# EAGLE design bvm (EAGLE 8.3.2)
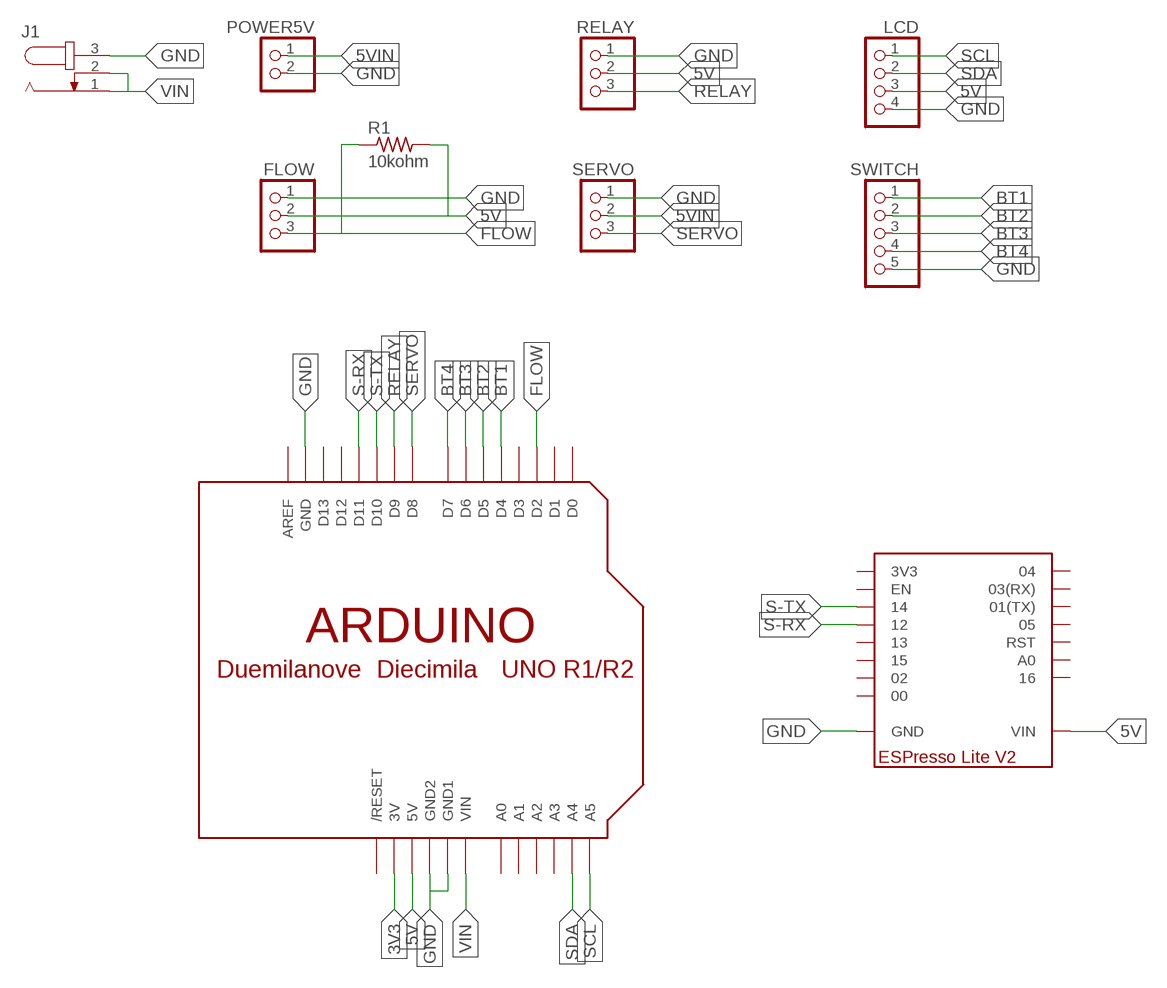
[diagram p0: schematic, sheet 1]

## Parts
FLOW  PINHD-1X3  [1X03]
J1  JACK-PLUG0  [SPC4077]
LCD  PINHD-1X4  [1X04]
POWER5V  PINHD-1X2  [1X02]
R1  10kohm  R-US_0207/10  [0207/10]
RELAY  PINHD-1X3  [1X03]
SERVO  PINHD-1X3  [1X03]
SWITCH  PINHD-1X5  [1X05]
U$1  ARDUINOUNO  [ARDUINO]
U$2  ESPRESSO-LITE-V2  [ESPRESSO-LITE-V2]

## Nets
3V3: U$1.3V
5V: FLOW.2 LCD.3 R1.2 RELAY.2 U$1.5V U$2.VIN1(VIN) U$2.VIN2(VIN)
5VIN: POWER5V.1 SERVO.2
BT1: SWITCH.1 U$1.D4
BT2: SWITCH.2 U$1.D5
BT3: SWITCH.3 U$1.D6
BT4: SWITCH.4 U$1.D7
FLOW: FLOW.3 R1.1 U$1.D2
GND: FLOW.1 J1.3 LCD.4 POWER5V.2 RELAY.1 SERVO.1 SWITCH.5 U$1.GND U$1.GND1 U$1.GND2 U$2.GND1(GND) U$2.GND2(GND) U$2.GND3(GND)
RELAY: RELAY.3 U$1.D9
S-RX: U$1.D11 U$2.12
S-TX: U$1.D10 U$2.14
SCL: LCD.1 U$1.A5
SDA: LCD.2 U$1.A4
SERVO: SERVO.3 U$1.D8
VIN: J1.1 J1.2 U$1.VIN
Unconnected: U$1.A0 U$1.A1 U$1.A2 U$1.A3 U$1.AREF U$1.D0 U$1.D1 U$1.D3 U$1.D12 U$1.D13 U$1.RESET(/RESET) U$2.00 U$2.01(01(TX)) U$2.02 U$2.03(03(RX)) U$2.3V3 U$2.04 U$2.05 U$2.13 U$2.15 U$2.16 U$2.AO(A0) U$2.EN U$2.RST

## Library data of the parts
FLOW RELAY SERVO = pinhead:PINHD-1X3: PIN HEADER
J1 = con-jack:JACK-PLUG: DC POWER JACK Power Jack, DC, Right Angle, Through Hole, Rated 5A at 16VDC, PC Terminals Distributor: Farnell (www.Farnell.de) Drawing: 84N1161.pdf / 84N1162.pdf Manufacturer: SPC Technology (www.spctechnology.com) Type: SPC4077 / SPC 4078; OC_FARNELL: unknown; OC_NEWARK: unknown
LCD = pinhead:PINHD-1X4: PIN HEADER
POWER5V = pinhead:PINHD-1X2: PIN HEADER
R1 = adafruit:R-US_: RESISTOR, American symbol
SWITCH = pinhead:PINHD-1X5: PIN HEADER
U$1 = adafruit:ARDUINO: Arduino Diecimila/Duemilanove Make a shield with ease, this package has all the named pins as well as the two mounting drill holes and an outline of the USB and DC power connector. The outline is on the DIMENSION layer, so if your board house uses it they will cut the outline to match. http://www.ladyada.net/library/pcb/eaglelibrary.html
U$2 = cmmc_lbr1:ESPRESSO-LITE-V2

## Board
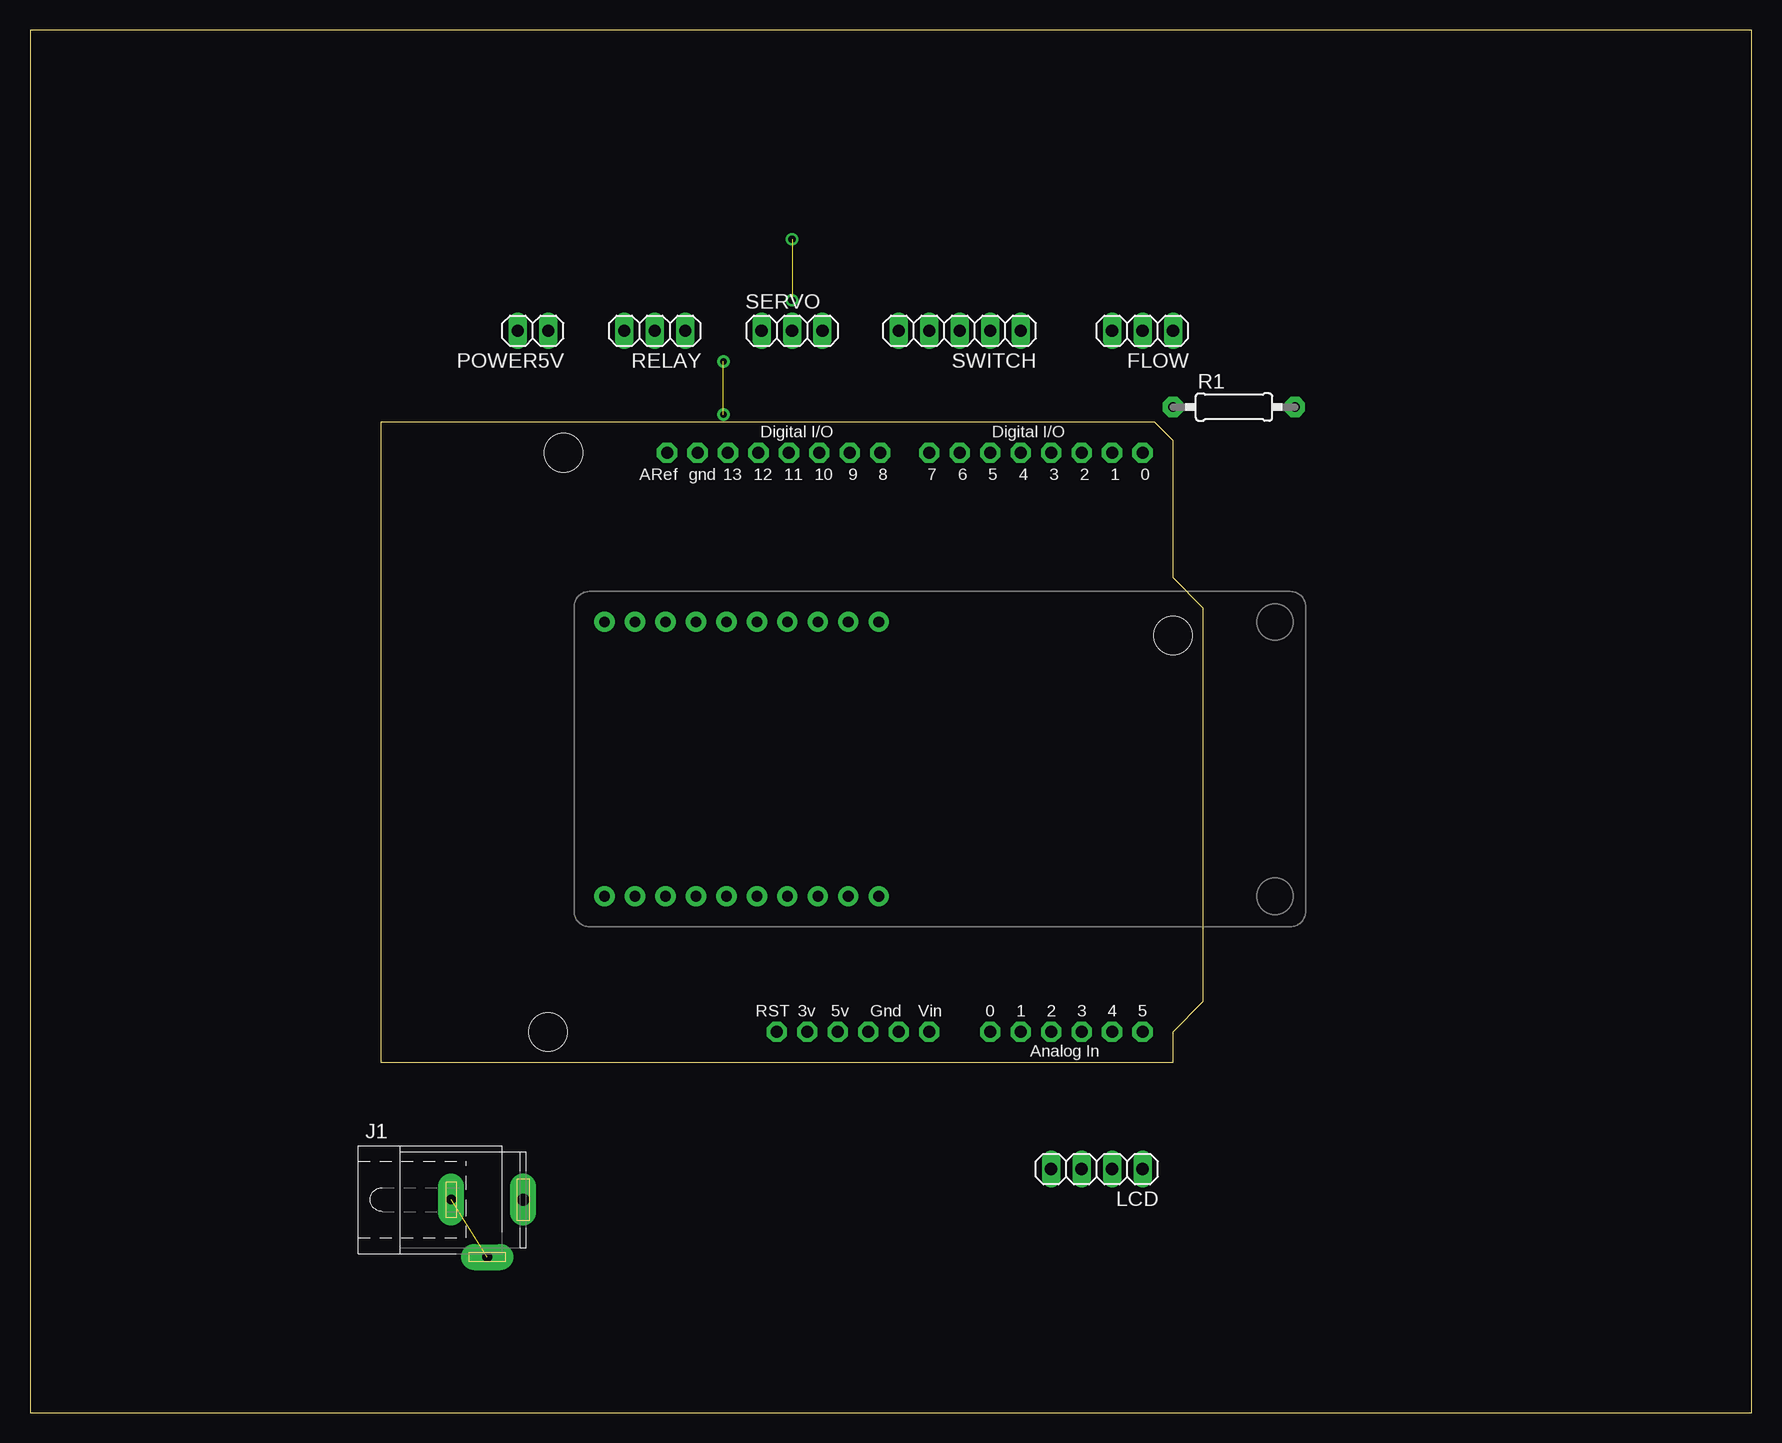
[diagram p1: board, top side]
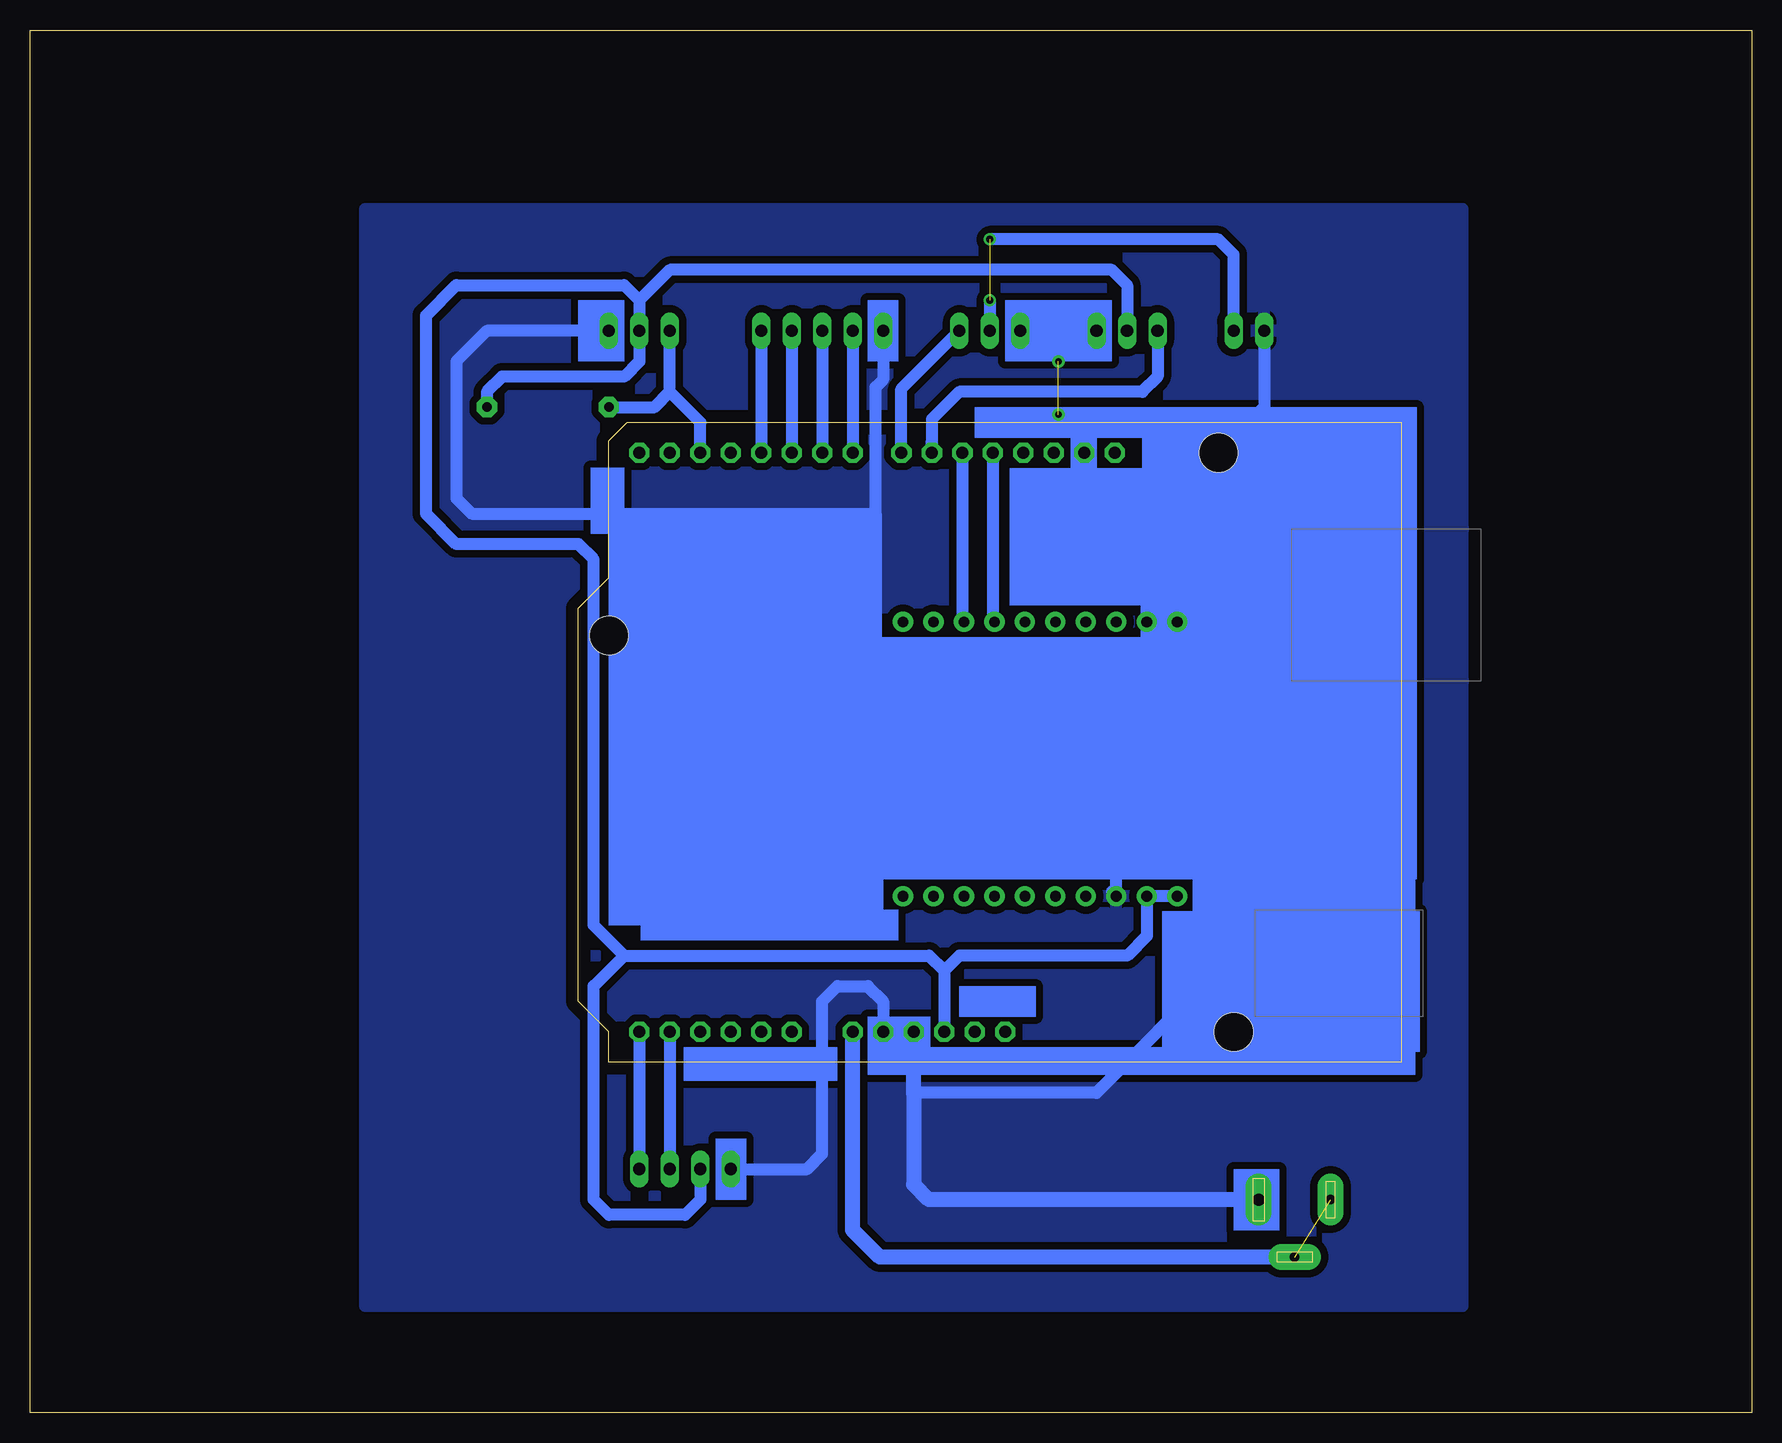
[diagram p2: board, bottom side, seen from below]

Size 143.49 x 115.24 mm. Coordinates in mm from the lower left corner, seen from the top.
Outline: 0,0 143.49,0 143.49,115.24 0,115.24 0,0
Copper layers (1*16): Top 0.035mm / dielectric 1.5mm / Bottom 0.035mm
Design rules "default": minimum track width 6mil, minimum drill 0.35mm, track to track 6mil, track to pad 6mil, pad to pad 6mil, via to via 6mil, smd to smd 6mil, copper to edge 40mil, drill to drill 6mil, minimum pad ring 10mil, minimum via ring 8mil, stop-mask expansion 4mil, vias tented up to drill 0mil, thermal gap 10mil

### Footprints (pad centres in the part's own frame; a part is rotated, then mirrored left to right if it is on the bottom)
1X03 = drill 1.016 long: 1 -2.54,0; 2 0,0; 3 2.54,0
SPC4077 = drill 0.8 pad 2.184 long: 1 -3,0; 2 0,-4.8 | drill 1 pad 2.184 long: 3 3,0
1X04 = drill 1.016 long: 1 -3.81,0; 2 -1.27,0; 3 1.27,0; 4 3.81,0
1X02 = drill 1.016 long: 1 -1.27,0; 2 1.27,0
0207/10 = drill 0.813 pad 1.676 octagon: 1 -5.08,0; 2 5.08,0
1X05 = drill 1.016 long: 1 -5.08,0; 2 -2.54,0; 3 0,0; 4 2.54,0; 5 5.08,0
ARDUINO = drill 1 pad 1.676 octagon: 3V 35.56,2.54; 5V 38.1,2.54; A0 50.8,2.54; A1 53.34,2.54; A2 55.88,2.54; A3 58.42,2.54; A4 60.96,2.54; A5 63.5,2.54; AREF 23.876,50.8; D0 63.5,50.8; D1 60.96,50.8; D2 58.42,50.8; D3 55.88,50.8; D4 53.34,50.8; D5 50.8,50.8; D6 48.26,50.8; D7 45.72,50.8; D8 41.656,50.8; D9 39.116,50.8; D10 36.576,50.8; D11 34.036,50.8; D12 31.496,50.8; D13 28.956,50.8; GND 26.416,50.8; GND1 43.18,2.54; GND2 40.64,2.54; RESET 33.02,2.54; VIN 45.72,2.54 | hole 3.2: 15.24,50.8; 66.04,35.56; 13.97,2.54
ESPRESSO-LITE-V2 = drill 0.9 pad 1.676: 00 2.54,7.62; 01 25.4,20.32; 02 2.54,10.16; 03 25.4,22.86; 3V3 2.54,25.4; 04 25.4,25.4; 05 25.4,17.78; 12 2.54,17.78; 13 2.54,15.24; 14 2.54,20.32; 15 2.54,12.7; 16 25.4,10.16; AO 25.4,12.7; EN 2.54,22.86; GND1 2.54,2.54; GND2 2.54,5.08; GND3 25.4,7.62; RST 25.4,15.24; VIN1 25.4,2.54; VIN2 25.4,5.08

### Placement (x,y rotation side)
FLOW  92.71,90.17 180 top
J1  38.1,17.78 0 top
LCD  88.9,20.32 180 top
POWER5V  41.91,90.17 180 top
R1  100.33,83.82 0 top
RELAY  52.07,90.17 180 top
SERVO  63.5,90.17 0 top
SWITCH  77.47,90.17 180 top
U$1  29.21,29.21 0 top
U$2  45.34,68.45 270 top

### Tracks (layer width: path | path; a pad name or v marks a point on that pad's centre or on a via)
5V
  Bottom 1.016: U$2.VIN1 U$2.VIN2 50.42,39.75 52.07,38.1 66.04,38.1 67.31,36.83 | RELAY.2 52.07,93.98 53.34,95.25 90.17,95.25 92.71,92.71 | R1.2 105.41,85.09 104.14,86.36 93.98,86.36 92.71,87.63 FLOW.2 92.71,92.71 | LCD.3 87.63,17.78 88.9,16.51 95.25,16.51 96.52,17.78 96.52,35.56 93.98,38.1 | 93.98,38.1 68.58,38.1 67.31,36.83 | 67.31,36.83 U$1.5V | 93.98,38.1 96.52,40.64 96.52,71.12 97.79,72.39 107.95,72.39 110.49,74.93 110.49,91.44 107.95,93.98 93.98,93.98 92.71,92.71
5VIN  (via drill 0.6)  (1 unrouted)
  Bottom 1.016: POWER5V.1 43.18,96.52 44.45,97.79 v63.5,97.79 | v63.5,92.71 SERVO.2
BT1
  Bottom 1.016: SWITCH.1 U$1.D4
BT2
  Bottom 1.016: SWITCH.2 U$1.D5
BT3
  Bottom 1.016: SWITCH.3 U$1.D6
BT4
  Bottom 1.016: SWITCH.4 U$1.D7
FLOW
  Bottom 1.016: 90.17,85.09 91.44,83.82 R1.1 | 90.17,85.09 FLOW.3 | U$1.D2 87.63,82.55 90.17,85.09
GND  (via drill 0.55 pad 1.05)  (1 unrouted)
  Bottom 1.016: U$2.GND1 U$2.GND2 | U$2.GND2 50.42,70.74 52.07,72.39 54.61,72.39 55.88,73.66 55.88,79.76 | 55.88,79.76 U$1.GND | 69.85,26.67 54.61,26.67 44.45,36.83 44.45,44.45 50.42,50.42 | 53.34,43.43 U$2.GND3 52.96,47.88 50.42,50.42 | 50.42,62.23 U$2.GND2 | 50.42,62.23 50.42,50.42 | 73.03,74.93 73.03,85.47 72.39,86.11 SWITCH.5 | 73.03,74.93 73.03,62.87 72.39,62.23 50.42,62.23 | 57.78,90.17 RELAY.1 | 57.78,90.17 SERVO.1 | v57.78,83.19 56.52,83.19 55.88,82.55 | 55.88,82.55 55.88,79.76 | v57.78,87.63 57.78,90.17 | FLOW.1 105.41,90.17 107.95,87.63 107.95,76.2 106.68,74.93 73.03,74.93 | LCD.4 78.74,20.32 77.47,21.59 77.47,34.29 76.2,35.56 73.66,35.56 72.39,34.29 U$1.GND1 | POWER5V.2 40.64,83.82 41.91,82.55 55.88,82.55
  Bottom 1.27: U$1.GND1 U$1.GND2 69.85,26.67 69.85,19.05 68.58,17.78 J1.3
  pour Bottom (isolate 0.61): 24.13,100.33 24.13,8.89 115.57,8.89 115.57,100.33
RELAY
  Bottom 1.016: 68.33,81.03 U$1.D9 68.33,82.8 66.04,85.09 50.8,85.09 49.53,86.36 RELAY.3
S-RX
  Bottom 1.016: U$1.D11 63.25,66.04 U$2.12
S-TX
  Bottom 1.016: U$1.D10 65.79,66.04 U$2.14
SCL
  Bottom 1.016: U$1.A5 LCD.1
SDA
  Bottom 1.016: U$1.A4 LCD.2
SERVO
  Bottom 1.016: U$1.D8 70.87,85.34 SERVO.3
VIN  (1 unrouted)
  Bottom 1.27: J1.2 72.67,12.98 74.93,15.24 U$1.VIN
(copper drawn outside any net)
  shapes: Bottom area x30